# Altium schematic sheet Sheet_1_2024-03-05.schdoc
size 377 x 322 mm
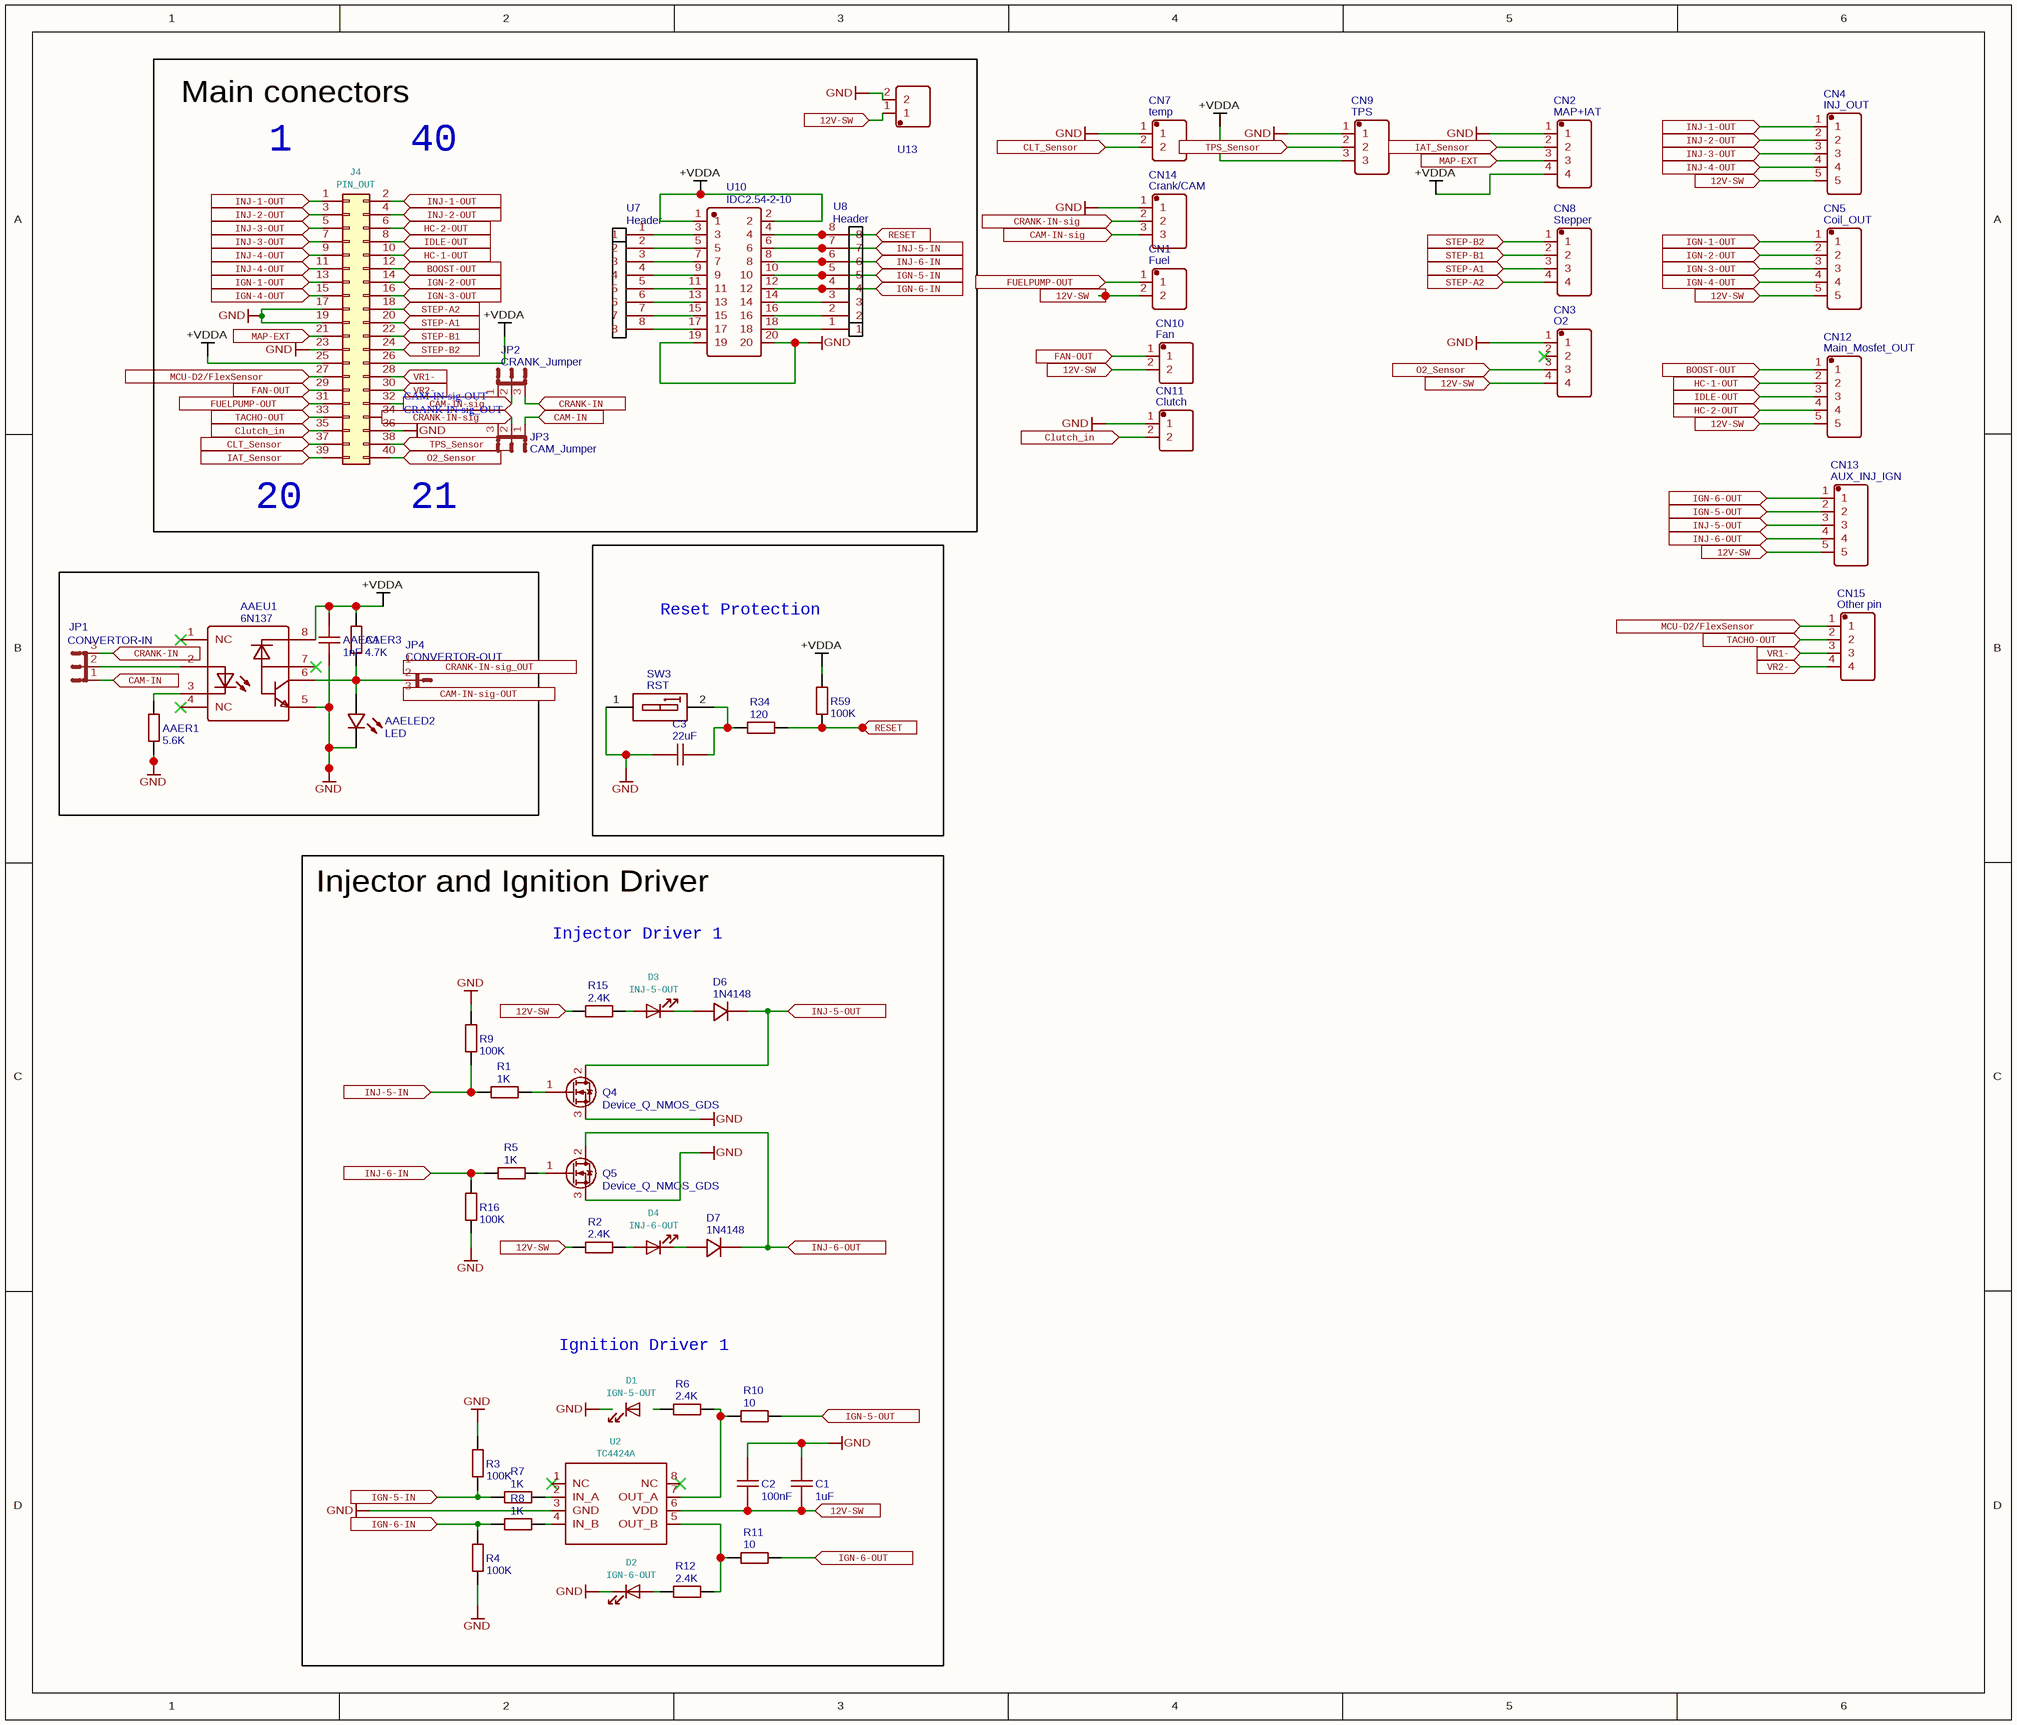
[diagram p0: Sheet_1_2024-03-05.schdoc]

## Parts
AAEC1  1nF  [C0805]
AAELED2  LED  [LED0805-R-RD]
AAER1  5.6K  [R0805]
AAER3  4.7K  [R0805]
AAEU1  6N137  [DIP-8_L9.7-W6.4-P2.54-LS7.6-BL]
C1  1uF  [C0805]
C2  100nF  [C0805]
C3  22uF  [C0805]
CN1  Fuel  [PHONIX 2PIN (5.08MM)]
CN2  MAP+IAT  [PHONIX 4PIN (5.08MM)]
CN3  O2  [PHONIX 4PIN (5.08MM)]
CN4  INJ_OUT  [PHONIX 5PIN (5.08MM)]
CN5  Coil_OUT  [PHONIX 5PIN (5.08MM)]
CN7  temp  [PHONIX 2PIN (5.08MM)]
CN8  Stepper  [PHONIX 4PIN (5.08MM)]
CN9  TPS  [PHONIX 3PIN (5.08MM)]
CN10  Fan  [PHONIX 2PIN (5.08MM)]
CN11  Clutch  [PHONIX 2PIN (5.08MM)]
CN12  Main_Mosfet_OUT  [PHONIX 5PIN (5.08MM)]
CN13  AUX_INJ_IGN  [PHONIX 5PIN (5.08MM)]
CN14  Crank/CAM  [PHONIX 3PIN (5.08MM)]
CN15  Other pin  [PHONIX 4PIN (5.08MM)]
D1  IGN-5-OUT  [LED0805_RED]
D2  IGN-6-OUT  [LED0805_RED]
D3  INJ-5-OUT  [LED0805_RED]
D4  INJ-6-OUT  [LED0805_RED]
D6  1N4148  [SOD-323_L1.8-W1.3-LS2.5-RD]
D7  1N4148  [SOD-323_L1.8-W1.3-LS2.5-RD]
J4  PIN_OUT  [IDC-HEADER_2X20_P2.54MM_VERTICAL]
JP1  CONVERTOR-IN  [JUMPER 3X1 (PIN= 2.54)]
JP2  CRANK_Jumper  [JUMPER 3X1 (PIN= 2.54)]
JP3  CAM_Jumper  [JUMPER 3X1 (PIN= 2.54)]
JP4  CONVERTOR-OUT  [JUMPER 3X1 (PIN= 2.54)]
Q4  Device_Q_NMOS_GDS  [TO-220_Q_NMOS_GDS]
Q5  Device_Q_NMOS_GDS  [TO-220_Q_NMOS_GDS]
R1  1K  [R0805]
R2  2.4K  [R0805]
R3  100K  [R0805]
R4  100K  [R0805]
R5  1K  [R0805]
R6  2.4K  [R0805]
R7  1K  [R0805]
R8  1K  [R0805]
R9  100K  [R0805]
R10  10  [R0805]
R11  10  [R0805]
R12  2.4K  [R0805]
R15  2.4K  [R0805]
R16  100K  [R0805]
R34  120  [R0805]
R59  100K  [R0805]
SW3  RST  [SW-SMD_L5.4-W2.8-LS8.2]
U2  TC4424A  [SOIC-8_3.9X4.9MM_P1.27MM]
U7  Header  [1X8 HEADER (PIN = 2.54)]
U8  Header  [1X8 HEADER (PIN = 2.54)]
U10  IDC2.54-2-10  [IDC-TH_20P-P2.54_ZX-IDC2.54-2-10PZZ]
U13  Power Input  [PHONIX 2PIN (5.08MM)]  (value not drawn)

## Blocks framed on the sheet
Reset Protection: C3 R34 R59 SW3
Injector and Ignition Driver: C1 C2 D1-D4 D6 D7 Q4 Q5 R1-R12 R15 R16 U2

## Ports
12V-SW (in), BOOST-OUT (in), CAM-IN (in), CAM-IN-sig (in), CAM-IN-sig-OUT (in), CLT_Sensor (in), Clutch_in (in), CRANK-IN (in), CRANK-IN-sig (in), CRANK-IN-sig_OUT (in), FAN-OUT (in), FUELPUMP-OUT (in), HC-1-OUT (in), HC-2-OUT (in), IAT_Sensor (in), IDLE-OUT (in), IGN-1-OUT (in), IGN-2-OUT (in), IGN-3-OUT (in), IGN-4-OUT (in), IGN-5-IN (in), IGN-5-OUT (in), IGN-6-IN (in), IGN-6-OUT (in), INJ-1-OUT (in), INJ-2-OUT (in), INJ-3-OUT (in), INJ-4-OUT (in), INJ-5-IN (in), INJ-5-OUT (in), INJ-6-IN (in), INJ-6-OUT (in), MAP-EXT (in), MCU-D2/FlexSensor (in), O2_Sensor (in), RESET (in), STEP-A1 (in), STEP-A2 (in), STEP-B1 (in), STEP-B2 (in), TACHO-OUT (in), TPS_Sensor (in), VR1- (in), VR2- (in)

## Nets
+VDDA: AAEC1.1 AAER3.2 AAEU1.8 CN2.4 CN9.3 J4.25(Pin_25) J4.26(Pin_26) R59.1 U10.1 U10.2
GND: AAEC1.2 AAELED2.2(C) AAER1.2 AAEU1.5 C1.2 C2.2 C3.2 CN2.1 CN3.1 CN7.1 CN9.1 CN11.1 CN14.1 D2.1(K) J4.17(Pin_17) J4.19(Pin_19) J4.23(Pin_23) J4.36(Pin_36) Q4.3(S) Q5.3(S) R3.1 R4.2 R9.1 R16.2 SW3.1(A1) U2.3(GND) U10.19 U10.20 U13.2
12V-SW: C1.1 C2.1 CN1.2 CN3.4 CN4.5 CN5.5 CN10.2 CN12.5 CN13.5 R2.1 R15.1 U2.6(VDD) U13.1 ; port 12V-SW
BOOST-OUT: CN12.1 J4.12(Pin_12) ; port BOOST-OUT
CAM-IN: JP1.1 JP3.1 ; port CAM-IN
CAM-IN-sig-OUT: CN14.3 J4.32(Pin_32) JP2.1 JP2.2 ; port CAM-IN-sig
CAM-IN-sig-OUT: JP4.3 ; port CAM-IN-sig-OUT  [a separate net that carries the same name]
CLT_Sensor: CN7.2 J4.37(Pin_37) ; port CLT_Sensor
Clutch_in: CN11.2 J4.35(Pin_35) ; port Clutch_in
CRANK-IN: JP1.3 JP2.3 ; port CRANK-IN
CRANK-IN-sig: CN14.2 JP3.2 ; port CRANK-IN-sig
CRANK-IN-sig_OUT: J4.34(Pin_34) JP3.3
CRANK-IN-sig_OUT: JP4.1 ; port CRANK-IN-sig_OUT  [a separate net that carries the same name]
FAN-OUT: CN10.1 J4.29(Pin_29) ; port FAN-OUT
FUELPUMP-OUT: CN1.1 J4.31(Pin_31) ; port FUELPUMP-OUT
HC-1-OUT: CN12.2 J4.10(Pin_10) ; port HC-1-OUT
HC-2-OUT: CN12.4 J4.6(Pin_6) ; port HC-2-OUT
IAT_Sensor: CN2.2 J4.39(Pin_39) ; port IAT_Sensor
IDLE-OUT: CN12.3 J4.8(Pin_8) ; port IDLE-OUT
IGN-1-OUT: CN5.1 J4.13(Pin_13) ; port IGN-1-OUT
IGN-2-OUT: CN5.2 J4.14(Pin_14) ; port IGN-2-OUT
IGN-3-OUT: CN5.3 J4.16(Pin_16) ; port IGN-3-OUT
IGN-4-OUT: CN5.4 J4.15(Pin_15) ; port IGN-4-OUT
IGN-5-IN: R3.2 R7.1 U8.5 U10.10 ; port IGN-5-IN
IGN-5-OUT: CN13.2 R10.1 ; port IGN-5-OUT
IGN-6-IN: R4.1 R8.1 U8.4 U10.12 ; port IGN-6-IN
IGN-6-OUT: CN13.1 R11.1 ; port IGN-6-OUT
INJ-1-OUT: CN4.1 J4.1(Pin_1) J4.2(Pin_2) ; port INJ-1-OUT
INJ-2-OUT: CN4.2 J4.3(Pin_3) J4.4(Pin_4) ; port INJ-2-OUT
INJ-3-OUT: CN4.3 J4.5(Pin_5) J4.7(Pin_7) ; port INJ-3-OUT
INJ-4-OUT: CN4.4 J4.9(Pin_9) J4.11(Pin_11) ; port INJ-4-OUT
INJ-5-IN: R1.1 R9.2 U8.7 U10.6 ; port INJ-5-IN
INJ-5-OUT: CN13.3 D6.2(C) Q4.2(D) ; port INJ-5-OUT
INJ-6-IN: R5.1 R16.1 U8.6 U10.8 ; port INJ-6-IN
INJ-6-OUT: CN13.4 D7.2(C) Q5.2(D) ; port INJ-6-OUT
MAP-EXT: CN2.3 J4.21(Pin_21) ; port MAP-EXT
MCU-D2/FlexSensor: CN15.1 J4.27(Pin_27) ; port MCU-D2/FlexSensor
O2_Sensor: CN3.3 J4.40(Pin_40) ; port O2_Sensor
RESET: R34.2 R59.2 U8.8 U10.4 ; port RESET
STEP-A1: CN8.3 J4.20(Pin_20) ; port STEP-A1
STEP-A2: CN8.4 J4.18(Pin_18) ; port STEP-A2
STEP-B1: CN8.2 J4.22(Pin_22) ; port STEP-B1
STEP-B2: CN8.1 J4.24(Pin_24) ; port STEP-B2
TACHO-OUT: CN15.2 J4.33(Pin_33) ; port TACHO-OUT
TPS_Sensor: CN9.2 J4.38(Pin_38) ; port TPS_Sensor
VR1-: CN15.3 J4.28(Pin_28) ; port VR1-
VR2-: CN15.4 J4.30(Pin_30) ; port VR2-
NetAAELED2_1: AAELED2.1(A) AAER3.1 AAEU1.6 JP4.2
NetAAER1_1: AAER1.1 AAEU1.3
NetAAEU1_2: AAEU1.2 JP1.2
NetC3_1: C3.1 R34.1 SW3.2(B1)
NetD2_2: D2.2(A) R12.1
NetD3_1: D3.1(K) D6.1(A)
NetD3_2: D3.2(A) R15.2
NetD4_1: D4.1(K) D7.1(A)
NetD4_2: D4.2(A) R2.2
NetQ4_1: Q4.1(G) R1.2
NetQ5_1: Q5.1(G) R5.2
NetR6_2: R6.2 R10.2 U2.7(OUT_A)
NetR7_2: R7.2 U2.2(IN_A)
NetR8_2: R8.2 U2.4(IN_B)
NetR11_2: R11.2 R12.2 U2.5(OUT_B)
NetU7_1: U7.1 U10.3
NetU7_2: U7.2 U10.5
NetU7_3: U7.3 U10.7
NetU7_4: U7.4 U10.9
NetU7_5: U7.5 U10.11
NetU7_6: U7.6 U10.13
NetU7_7: U7.7 U10.15
NetU7_8: U7.8 U10.17
NetU8_1: U8.1 U10.18
NetU8_2: U8.2 U10.16
NetU8_3: U8.3 U10.14

Not connected (* = marked no-connect by the designer): AAEU1 1(NC)* 4(NC)* 7*; CN3 2*; R6 1; U2 1(NC)* 8(NC)*

## Notes on the sheet
- Main conectors
- 1
- 40
- (near J4) 20
- 21
- Injector Driver 1
- Ignition Driver 1

## Library data of the parts
AAEC1 = 1nF: Manufacturer: YAGEO; Manufacturer Part: CC0805KRX7RBBB222; nameAlias: Capacitance; Contributor: LCSC; Supplier: LCSC; Supplier Part: C326760; spicePre: C; spiceSymbolName: CC0805KRX7RBBB222
AAELED2 = LED: Manufacturer: Everlight Elec; Manufacturer Part: 17-215/G6C-BM1N2L/3T; Contributor: LCSC; Supplier: LCSC; Supplier Part: C94615; spicePre: L; spiceSymbolName: 17-215/G6C-BM1N2L/3T
AAER1 = 5.6K: Manufacturer: YAGEO; Manufacturer Part: RC0805FR-072K74L; nameAlias: Resistance (Ohms); Supplier: LCSC; Supplier Part: C137554; JLCPCB Part Class: Extended Part; spicePre: R; spiceSymbolName: RC0805FR-072K74L
AAER3 = 4.7K: Manufacturer: YAGEO; Manufacturer Part: RC0805FR-072K74L; nameAlias: Resistance (Ohms); Supplier: LCSC; Supplier Part: C137554; JLCPCB Part Class: Extended Part; spicePre: R; spiceSymbolName: RC0805FR-072K74L
AAEU1 = 6N137: Manufacturer: FAIRCHILD; Manufacturer Part: 6N135; Supplier: LCSC; Supplier Part: C4070; JLCPCB Part Class: Extended Part; spicePre: U; spiceSymbolName: 6N135
C1 = 1uF: Manufacturer: Kyocera AVX; Manufacturer Part: 08051C105KAT2A; nameAlias: Value; Contributor: LCSC; Supplier: LCSC; Supplier Part: C597292; JLCPCB Part Class: Extended Part; spicePre: C; spiceSymbolName: 08051C105KAT2A
C2 = 100nF: Manufacturer: Kyocera AVX; Manufacturer Part: 08051C105KAT2A; nameAlias: Value; Contributor: LCSC; Supplier: LCSC; Supplier Part: C597292; JLCPCB Part Class: Extended Part; spicePre: C; spiceSymbolName: 08051C105KAT2A
C3 = 22uF: Manufacturer: Kyocera AVX; Manufacturer Part: 08051C105KAT2A; nameAlias: Value; Contributor: LCSC; Supplier: LCSC; Supplier Part: C597292; JLCPCB Part Class: Extended Part; spicePre: C; spiceSymbolName: 08051C105KAT2A
CN1 = Fuel: Manufacturer: ReliaPro; Manufacturer Part: PH-12AW; Contributor: amir slz; spicePre: X; Supplier Part: C8883; spiceSymbolName: PHONIX 2PIN (5.08mm)
CN2 = MAP+IAT: Manufacturer: ReliaPro; Manufacturer Part: PH-12AW; Contributor: amir slz; spicePre: X; Supplier Part: C8883; Supplier: LCSC; spiceSymbolName: PHONIX 4PIN (5.08mm)
CN3 = O2: Manufacturer: ReliaPro; Manufacturer Part: PH-12AW; Contributor: amir slz; spicePre: X; Supplier Part: C8883; Supplier: LCSC; spiceSymbolName: PHONIX 4PIN (5.08mm)
CN4 = INJ_OUT: Manufacturer: ReliaPro; Manufacturer Part: PH-12AW; Contributor: amir slz; spicePre: X; Supplier Part: C8883; Supplier: LCSC; spiceSymbolName: PHONIX 5PIN (5.08mm)
CN5 = Coil_OUT: Manufacturer: ReliaPro; Manufacturer Part: PH-12AW; Contributor: amir slz; spicePre: X; Supplier Part: C8883; Supplier: LCSC; spiceSymbolName: PHONIX 5PIN (5.08mm)
CN7 = temp: Manufacturer: ReliaPro; Manufacturer Part: PH-12AW; Contributor: amir slz; spicePre: X; Supplier Part: C8883; spiceSymbolName: PHONIX 2PIN (5.08mm)
CN8 = Stepper: Manufacturer: ReliaPro; Manufacturer Part: PH-12AW; Contributor: amir slz; spicePre: X; Supplier Part: C8883; Supplier: LCSC; spiceSymbolName: PHONIX 4PIN (5.08mm)
CN9 = TPS: Manufacturer: ReliaPro; Manufacturer Part: PH-12AW; Contributor: amir slz; spicePre: X; Supplier Part: C8883; Supplier: LCSC; spiceSymbolName: PHONIX 3PIN (5.08mm)
CN10 = Fan: Manufacturer: ReliaPro; Manufacturer Part: PH-12AW; Contributor: amir slz; spicePre: X; Supplier Part: C8883; spiceSymbolName: PHONIX 2PIN (5.08mm)
CN11 = Clutch: Manufacturer: ReliaPro; Manufacturer Part: PH-12AW; Contributor: amir slz; spicePre: X; Supplier Part: C8883; spiceSymbolName: PHONIX 2PIN (5.08mm)
CN12 = Main_Mosfet_OUT: Manufacturer: ReliaPro; Manufacturer Part: PH-12AW; Contributor: amir slz; spicePre: X; Supplier Part: C8883; Supplier: LCSC; spiceSymbolName: PHONIX 5PIN (5.08mm)
CN13 = AUX_INJ_IGN: Manufacturer: ReliaPro; Manufacturer Part: PH-12AW; Contributor: amir slz; spicePre: X; Supplier Part: C8883; Supplier: LCSC; spiceSymbolName: PHONIX 5PIN (5.08mm)
CN14 = Crank/CAM: Manufacturer: ReliaPro; Manufacturer Part: PH-12AW; Contributor: amir slz; spicePre: X; Supplier Part: C8883; Supplier: LCSC; spiceSymbolName: PHONIX 3PIN (5.08mm)
CN15 = Other pin: Manufacturer: ReliaPro; Manufacturer Part: PH-12AW; Contributor: amir slz; spicePre: X; Supplier Part: C8883; Supplier: LCSC; spiceSymbolName: PHONIX 4PIN (5.08mm)
D1 = IGN-5-OUT: Manufacturer_Name: Osram; Manufacturer_Part_Number: LH R974-LP-1; Digikey Part Number: 475-1415-1-ND; URL: https://www.digikey.com/product-detail/en/osram-opto-semiconductors-inc/LH-R974-LP-1/475-1415-1-ND/1802604
D2 = IGN-6-OUT: Manufacturer_Name: Osram; Manufacturer_Part_Number: LH R974-LP-1; Digikey Part Number: 475-1415-1-ND; URL: https://www.digikey.com/product-detail/en/osram-opto-semiconductors-inc/LH-R974-LP-1/475-1415-1-ND/1802604
D3 = INJ-5-OUT: Manufacturer_Name: Osram; Manufacturer_Part_Number: LH R974-LP-1; Digikey Part Number: 475-1415-1-ND; URL: https://www.digikey.com/product-detail/en/osram-opto-semiconductors-inc/LH-R974-LP-1/475-1415-1-ND/1802604
D4 = INJ-6-OUT: Manufacturer_Name: Osram; Manufacturer_Part_Number: LH R974-LP-1; Digikey Part Number: 475-1415-1-ND; URL: https://www.digikey.com/product-detail/en/osram-opto-semiconductors-inc/LH-R974-LP-1/475-1415-1-ND/1802604
D6 D7 = 1N4148: Manufacturer: DIODES(美台); Manufacturer Part: 1N4448HWSQ-7-F; Contributor: LCSC; Supplier: LCSC; Supplier Part: C526202; JLCPCB Part Class: Extended Part; spicePre: D; spiceSymbolName: 1N4448HWSQ-7-F
JP1 = CONVERTOR-IN: description: Jumper 2 Pin; Contributor: amir slz; sourceId: neOM8uspn; timeStamp: 1461241431; spicePre: J; spiceSymbolName: JUMPER 3X1 (PIN= 2.54)
JP2 = CRANK_Jumper: description: Jumper 2 Pin; Contributor: amir slz; sourceId: neOM8uspn; timeStamp: 1461241431; spicePre: J; spiceSymbolName: JUMPER 3X1 (PIN= 2.54)
JP3 = CAM_Jumper: description: Jumper 2 Pin; Contributor: amir slz; sourceId: neOM8uspn; timeStamp: 1461241431; spicePre: J; spiceSymbolName: JUMPER 3X1 (PIN= 2.54)
JP4 = CONVERTOR-OUT: description: Jumper 2 Pin; Contributor: amir slz; sourceId: neOM8uspn; timeStamp: 1461241431; spicePre: J; spiceSymbolName: JUMPER 3X1 (PIN= 2.54)
Q4 Q5 = Device_Q_NMOS_GDS: Contributor: amir slz; spicePre: Q; spiceSymbolName: Device_Q_NMOS_GDS
R1 R5 R7 R8 = 1K: Manufacturer: YAGEO; Manufacturer Part: RC0805FR-072K74L; nameAlias: Resistance (Ohms); Supplier: LCSC; Supplier Part: C137554; JLCPCB Part Class: Extended Part; spicePre: R; spiceSymbolName: RC0805FR-072K74L
R2 R6 R12 R15 = 2.4K: Manufacturer: YAGEO; Manufacturer Part: RC0805FR-072K74L; nameAlias: Resistance (Ohms); Supplier: LCSC; Supplier Part: C137554; JLCPCB Part Class: Extended Part; spicePre: R; spiceSymbolName: RC0805FR-072K74L
R3 R4 R9 R16 R59 = 100K: Manufacturer: YAGEO; Manufacturer Part: RC0805FR-072K74L; nameAlias: Resistance (Ohms); Supplier: LCSC; Supplier Part: C137554; JLCPCB Part Class: Extended Part; spicePre: R; spiceSymbolName: RC0805FR-072K74L
R10 R11 = 10: Manufacturer: YAGEO; Manufacturer Part: RC0805FR-072K74L; nameAlias: Resistance (Ohms); Supplier: LCSC; Supplier Part: C137554; JLCPCB Part Class: Extended Part; spicePre: R; spiceSymbolName: RC0805FR-072K74L
R34 = 120: Manufacturer: YAGEO; Manufacturer Part: RC0805FR-072K74L; nameAlias: Resistance (Ohms); Supplier: LCSC; Supplier Part: C137554; JLCPCB Part Class: Extended Part; spicePre: R; spiceSymbolName: RC0805FR-072K74L
SW3 = RST: Manufacturer: null; Manufacturer Part: BDSwitch-2pin-1CH-1r27-SMD-V; Contributor: lcsc; Supplier: LCSC; Supplier Part: C9900022896; JLCPCB Part Class: Extended Part; spicePre: S; spiceSymbolName: BDSWITCH-2PIN-1CH-1R27-SMD-V
U2 = TC4424A: Manufacturer_Name: IXYS; Manufacturer_Part_Number: IXDN602SIATR; Digikey Part Number: 212-IXDN602SIACT-ND; URL: https://www.digikey.com/en/products/detail/ixys-integrated-circuits-division/IXDN602SIATR/2424695
U7 U8 = Header: Manufacturer Part: Male Header 2 pin; Contributor: amir slz; spicePre: U; spiceSymbolName: 1X8 Header (Pin = 2.54)
U10 = IDC2.54-2-10: Manufacturer: Megastar(兆星); Manufacturer Part: ZX-IDC2.54-2-10PZZ; Contributor: lcsc; Supplier: LCSC; Supplier Part: C7501245; JLCPCB Part Class: Extended Part; spicePre: U; spiceSymbolName: ZX-IDC2.54-2-10PZZ
U13 = Power Input: Manufacturer: ReliaPro; Manufacturer Part: PH-12AW; Contributor: amir slz; spicePre: X; Supplier Part: C8883; spiceSymbolName: PHONIX 2PIN (5.08mm)